# Altium schematic sheet DRV8874.SchDoc
size A4; SheetNumber: 4; SheetTotal: 7
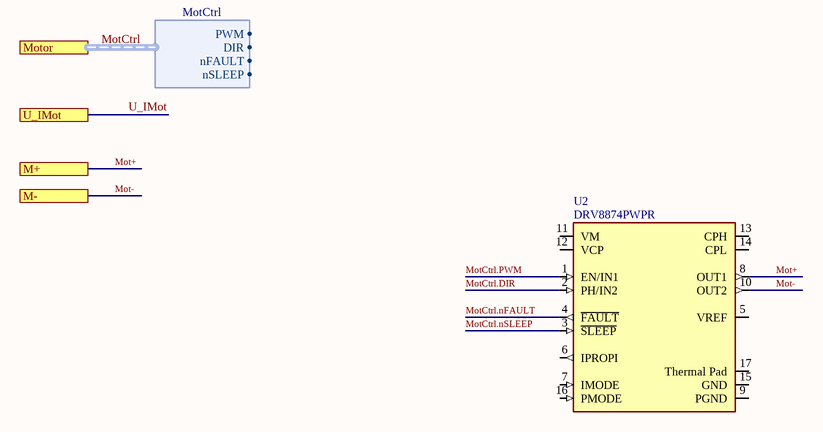
[diagram p0: DRV8874.SchDoc]

## Parts
U2  DRV8874PWPR  [FP-PWP0016J-MFG]

## Ports
M+, M-, Motor (harness MotCtrl), U_IMot

## Harnesses
MotCtrl: PWM, DIR, nFAULT, nSLEEP

## Nets
Mot+: U2.8(OUT1) ; port M+
Mot-: U2.10(OUT2) ; port M-
MotCtrl.DIR: U2.2(PH/IN2)
MotCtrl.nFAULT: U2.4(~{FAULT})
MotCtrl.nSLEEP: U2.3(~{SLEEP})
MotCtrl.PWM: U2.1(EN/IN1)
U_IMot: port U_IMot

Not connected (* = marked no-connect by the designer): U2 5(VREF) 6(IPROPI) 7(IMODE) 9(PGND) 11(VM) 12(VCP) 13(CPH) 14(CPL) 15(GND) 16(PMODE) 17(Thermal_Pad)

## Buses and harness runs
harness MotCtrl = port Motor

## Library data of the parts
U2 = CMP-00024-00019-A02: 40-V, 6-A H-bridge motor driver with integrated current sensing feedback 16-HTSSOP -40 to 125; Sink Current (Max): -6A; Working Voltage: 5V; Supply Voltage (Max): 37V; Supply Voltage (Min): 4.5V; Source Current (Max): 6A; Operating Temperature (Max): 125°C; Pins: 16; Mounting Technology: SMT; Operating Temperature (Min): -40°C; RoHS Compliant: 16; Case/Package: HTSSOP16